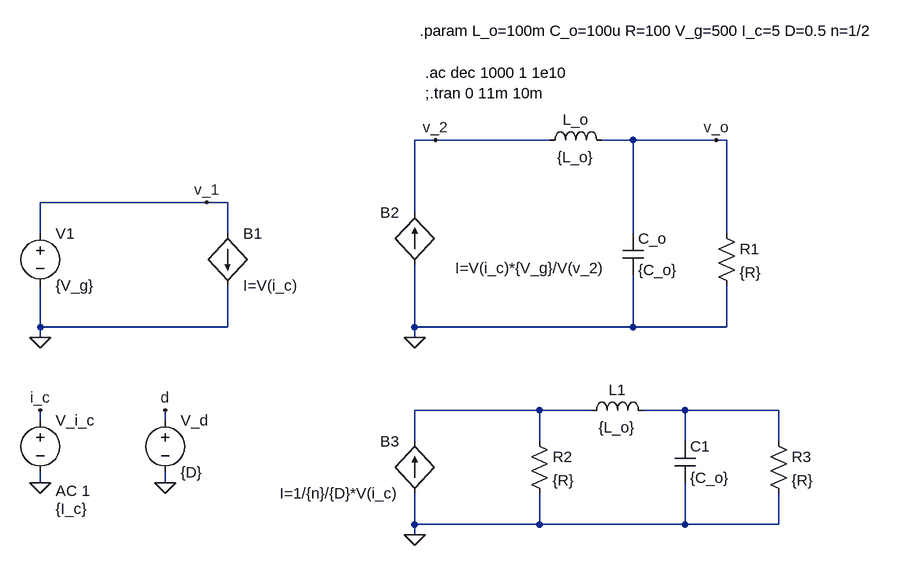
[diagram p0: schematic DC_DC_CPM_ASM.asc]
DC_DC_CPM_ASM.asc, the LTspice schematic file:
Version 4
SHEET 1 1448 680
WIRE 656 16 624 16
WIRE 832 16 656 16
WIRE 960 16 912 16
WIRE 1088 16 960 16
WIRE 1104 16 1088 16
WIRE 304 112 48 112
WIRE 336 112 304 112
WIRE 624 128 624 16
WIRE 48 160 48 112
WIRE 336 160 336 112
WIRE 960 160 960 16
WIRE 1104 160 1104 16
WIRE 48 304 48 240
WIRE 336 304 336 240
WIRE 336 304 48 304
WIRE 624 304 624 208
WIRE 960 304 960 224
WIRE 960 304 624 304
WIRE 1104 304 1104 240
WIRE 1104 304 960 304
WIRE 48 320 48 304
WIRE 624 320 624 304
WIRE 816 432 624 432
WIRE 896 432 816 432
WIRE 1040 432 976 432
WIRE 1184 432 1040 432
WIRE 48 448 48 432
WIRE 240 448 240 432
WIRE 624 480 624 432
WIRE 816 480 816 432
WIRE 1040 480 1040 432
WIRE 1184 480 1184 432
WIRE 48 544 48 528
WIRE 240 544 240 528
WIRE 624 608 624 560
WIRE 816 608 816 560
WIRE 816 608 624 608
WIRE 1040 608 1040 544
WIRE 1040 608 816 608
WIRE 1184 608 1184 560
WIRE 1184 608 1040 608
WIRE 624 624 624 608
FLAG 304 112 v_1
FLAG 48 320 0
FLAG 48 432 i_c
FLAG 48 544 0
FLAG 624 320 0
FLAG 240 432 d
FLAG 240 544 0
FLAG 1088 16 v_o
FLAG 656 16 v_2
FLAG 624 624 0
SYMBOL ind 816 32 R270
WINDOW 0 32 56 VTop 2
WINDOW 3 5 56 VBottom 2
SYMATTR InstName L_o
SYMATTR Value {L_o}
SYMBOL cap 944 160 R0
SYMATTR InstName C_o
SYMATTR Value {C_o}
SYMBOL res 1088 144 R0
SYMATTR InstName R1
SYMATTR Value {R}
SYMBOL bi 336 160 R0
SYMATTR InstName B1
SYMATTR Value I=V(i_c)
SYMBOL voltage 48 432 R0
WINDOW 3 24 152 Left 2
WINDOW 123 24 124 Left 2
WINDOW 39 0 0 Left 0
SYMATTR Value {I_c}
SYMATTR Value2 AC 1
SYMATTR InstName V_i_c
SYMBOL voltage 240 432 R0
SYMATTR InstName V_d
SYMATTR Value {D}
SYMBOL bi 624 208 R180
WINDOW 0 24 80 Left 2
WINDOW 3 -293 -5 Left 2
SYMATTR InstName B2
SYMATTR Value I=V(i_c)*{V_g}/V(v_2)
SYMBOL voltage 48 144 R0
SYMATTR InstName V1
SYMATTR Value {V_g}
SYMBOL bi 624 560 R180
WINDOW 0 24 80 Left 2
WINDOW 3 24 0 Left 2
SYMATTR InstName B3
SYMATTR Value I=1/{n}/{D}*V(i_c)
SYMBOL res 800 464 R0
SYMATTR InstName R2
SYMATTR Value {R}
SYMBOL cap 1024 480 R0
SYMATTR InstName C1
SYMATTR Value {C_o}
SYMBOL res 1168 464 R0
SYMATTR InstName R3
SYMATTR Value {R}
SYMBOL ind 880 448 R270
WINDOW 0 32 56 VTop 2
WINDOW 3 5 56 VBottom 2
SYMATTR InstName L1
SYMATTR Value {L_o}
TEXT 632 -152 Left 2 !.param L_o=100m C_o=100u R=100 V_g=500 I_c=5 D=0.5 n=1/2
TEXT 640 -88 Left 2 !.ac dec 1000 1 1e10
TEXT 640 -56 Left 2 !;.tran 0 11m 10m

The netlist it stands for:
* DC_DC_CPM_ASM.asc
L_o v_2 v_o {L_o}
C_o v_o 0 {C_o}
R1 v_o 0 {R}
B1 v_1 0 I=V(i_c)
V_i_c i_c 0 {I_c} AC 1
V_d d 0 {D}
B2 0 v_2 I=V(i_c)*{V_g}/V(v_2)
V1 v_1 0 {V_g}
B3 0 N001 I=1/{n}/{D}*V(i_c)
R2 N001 0 {R}
C1 N002 0 {C_o}
R3 N002 0 {R}
L1 N001 N002 {L_o}
.param L_o=100m C_o=100u R=100 V_g=500 I_c=5 D=0.5 n=1/2
.ac dec 1000 1 1e10
;.tran 0 11m 10m
.backanno
.end